# Altium schematic sheet main.SchDoc
size A4; PageSetup: Record=PageOptions|CenterHorizontal=True|CenterVertical=True|PrintScale=0.92|XCorrection=1.00|YCorrection=1.00|PrintKind=1|BorderSize=5000000|LeftOffset=0|BottomOffset=0|Orientation=2|PaperLength=1000|PaperWidth=1000|Scale=100|PaperSource=7|PrintQuality=-3|MediaType=1|DitherType=10|PaperKind=???|PrintScaleMode=1
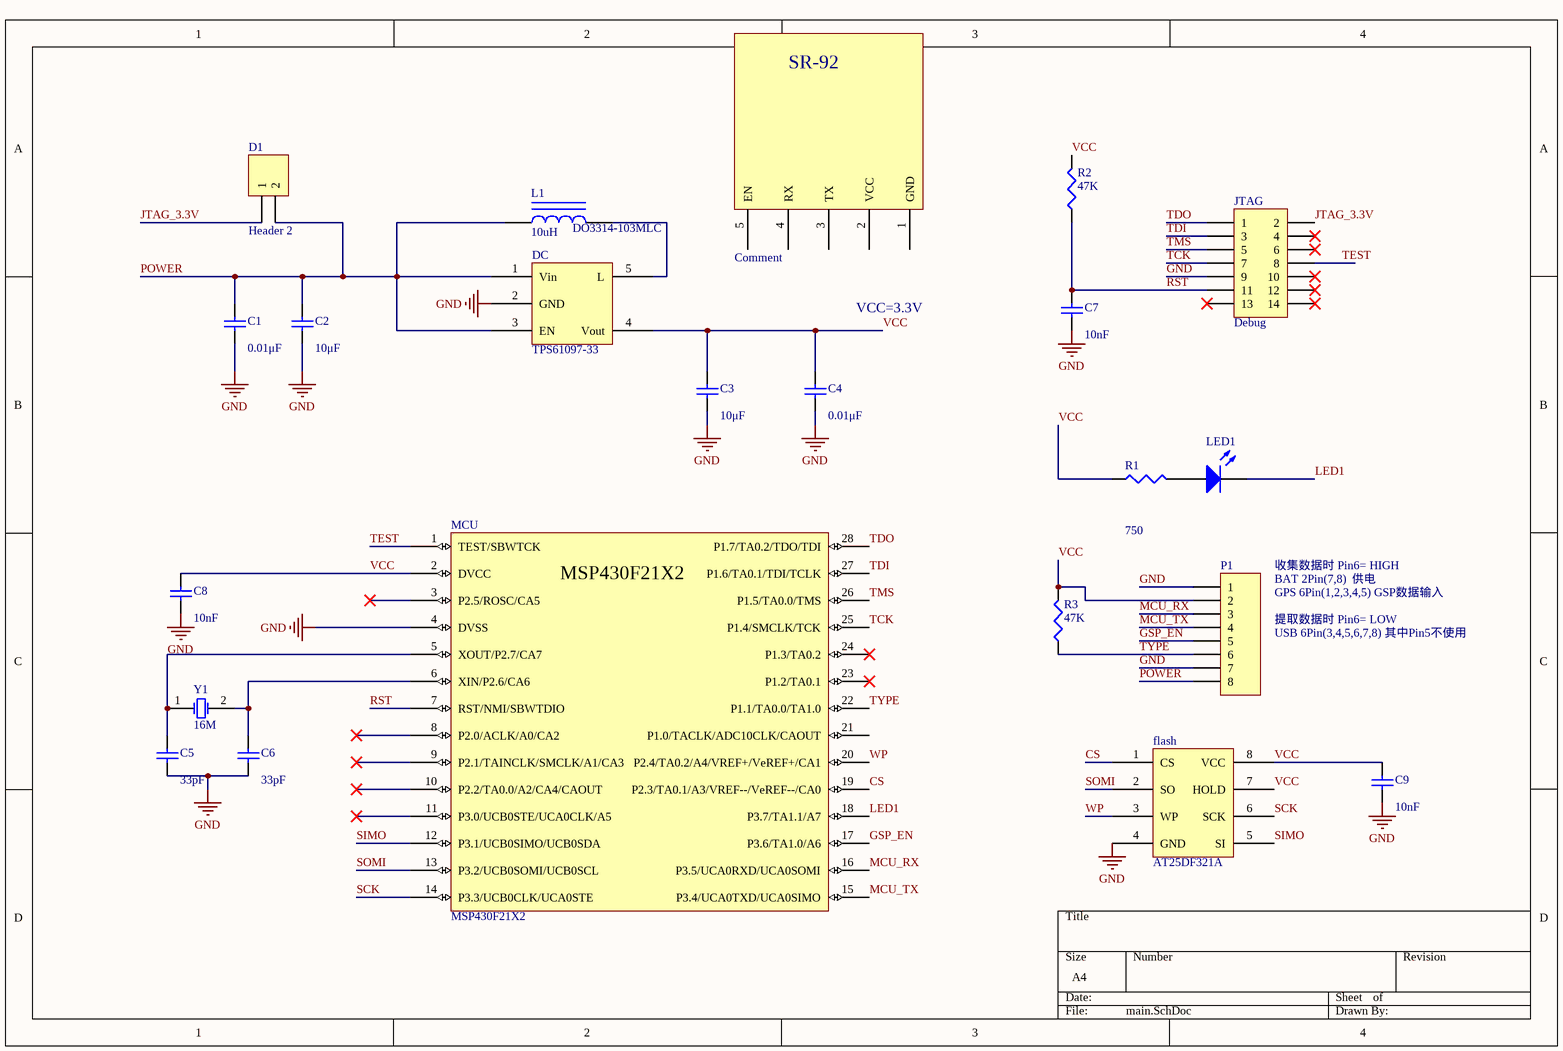
[diagram p0: main.SchDoc]

## Parts
?  Comment  [SR-92]
C1  value 0.01μF  [CAPC3216L]
C2  value 10μF  [CAPC3216L]
C3  value 10μF  [CAPC3216L]
C4  value 0.01μF  [CAPC3216L]
C5  value 33pF  [CAPC3216L]
C6  value 33pF  [CAPC3216L]
C7  value 10nF  [CAPC3216L]
C8  value 10nF  [CAPC3216L]
C9  value 10nF  [CAPC3216L]
D1  Header 2  [DO-41]
DC  TPS61097-33  [DBV005]
flash  AT25DF321A  [8S2_M]
JTAG  Debug  [HDR2X7]
L1  DO3314-103MLC  value 10uH  [DO3314]
LED1  LED2  [DSO-F2/D6.1]  (value not drawn)
MCU  MSP430F21X2  [PW028]
P1  Header 8H  [HDR1X8H]  (value not drawn)
R1  value 750  [RESC3216L]  (hidden comment: Res3)
R2  value 47K  [RESC3216L]  (hidden comment: Res3)
R3  value 47K  [RESC3216L]  (hidden comment: Res3)
Y1  16M  [DCO - 2]

## Nets
GND: C1.1 C2.1 C3.1 C4.1 C5.1 C6.1 C7.1 C8.1 C9.2 DC.2(GND) flash.4(GND) JTAG.9 MCU.4(DVSS) P1.1 P1.7
CS: flash.1(CS) MCU.19(P2.3/TA0.1/A3/VREF--/VeREF--/CA0)
GSP_EN: MCU.17(P3.6/TA1.0/A6) P1.5
JTAG_3.3V: D1.1 JTAG.2
LED1: LED1.2(K) MCU.18(P3.7/TA1.1/A7)
MCU_RX: MCU.16(P3.5/UCA0RXD/UCA0SOMI) P1.3
MCU_TX: MCU.15(P3.4/UCA0TXD/UCA0SIMO) P1.4
POWER: C1.2 C2.2 D1.2 DC.1(Vin) DC.3(EN) L1.1 P1.8
RST: C7.2 JTAG.11 MCU.7(RST/NMI/SBWTDIO) R2.1
SCK: flash.6(SCK) MCU.14(P3.3/UCB0CLK/UCA0STE)
SIMO: flash.5(SI) MCU.12(P3.1/UCB0SIMO/UCB0SDA)
SOMI: flash.2(SO) MCU.13(P3.2/UCB0SOMI/UCB0SCL)
TCK: JTAG.7 MCU.25(P1.4/SMCLK/TCK)
TDI: JTAG.3 MCU.27(P1.6/TA0.1/TDI/TCLK)
TDO: JTAG.1 MCU.28(P1.7/TA0.2/TDO/TDI)
TEST: JTAG.8 MCU.1(TEST/SBWTCK)
TMS: JTAG.5 MCU.26(P1.5/TA0.0/TMS)
TYPE: MCU.22(P1.1/TA0.0/TA1.0) P1.6 R3.1
VCC: C3.2 C4.2 C8.2 C9.1 DC.4(Vout) flash.7(HOLD) flash.8(VCC) MCU.2(DVCC) P1.2 R1.1 R2.2 R3.2
WP: flash.3(WP) MCU.20(P2.4/TA0.2/A4/VREF+/VeREF+/CA1)
NetC5_2: C5.2 MCU.5(XOUT/P2.7/CA7) Y1.1(OSC1)
NetC6_2: C6.2 MCU.6(XIN/P2.6/CA6) Y1.2(OSC2)
NetDC_5: DC.5(L) L1.2
NetLED1_1: LED1.1(A) R1.2

Not connected (* = marked no-connect by the designer): ? 1(GND) 2(VCC) 3(TX) 4(RX) 5(EN); JTAG 4* 6* 10* 12* 13* 14*; MCU 3(P2.5/ROSC/CA5)* 8(P2.0/ACLK/A0/CA2)* 9(P2.1/TAINCLK/SMCLK/A1/CA3)* 10(P2.2/TA0.0/A2/CA4/CAOUT)* 11(P3.0/UCB0STE/UCA0CLK/A5)* 21(P1.0/TACLK/ADC10CLK/CAOUT) 23(P1.2/TA0.1)* 24(P1.3/TA0.2)*

## Notes on the sheet
- VCC=3.3V
- GPS 6Pin(1,2,3,4,5) GSP数据输入
- BAT 2Pin(7,8)  供电
- 收集数据时 Pin6= HIGH
- USB 6Pin(3,4,5,6,7,8) 其中Pin5不使用
- 提取数据时 Pin6= LOW

## Library data of the parts
? = SR-92
C1-C9 = Cap Semi: Capacitor (Semiconductor SIM Model); Published: 8-Jun-2000; LatestRevisionDate: 29-May-2009; LatestRevisionNote: IPC-7351 Footprint Added.; PackageReference: C1206; Publisher: Altium Limited; PackageDescription: Chip Capacitor
D1 = Header 2: Header, 2-Pin; LatestRevisionDate: 17-Jul-2002; LatestRevisionNote: Re-released for DXP Platform.; Publisher: Altium Limited
JTAG = Header 7X2: Header, 7-Pin, Dual row; LatestRevisionDate: 17-Jul-2002; LatestRevisionNote: Re-released for DXP Platform.; Publisher: Altium Limited
L1 = Inductor Iron: Magnetic-Core Inductor; Published: 24-Mar-1999; LatestRevisionDate: 17-Jul-2002; LatestRevisionNote: Re-released for DXP Platform.; PackageReference: AXIAL-0.9; Publisher: Altium Limited
LED1 = LED2: Typical RED, GREEN, YELLOW, AMBER GaAs LED; Published: 8-Jun-2000; LatestRevisionDate: 17-Jul-2002; LatestRevisionNote: Re-released for DXP Platform.; PackageVersion: Feb-2002; PackageReference: 3.2X1.6X1.1; Publisher: Altium Limited
P1 = Header 8H: Header, 8-Pin, Right Angle; LatestRevisionDate: 17-Jul-2002; LatestRevisionNote: Re-released for DXP Platform.; Publisher: Altium Limited
R1-R3 = Res3: Resistor; Published: 8-Jun-2000; LatestRevisionDate: 29-May-2009; LatestRevisionNote: IPC-7351 Footprint Added.; PackageReference: J1-0603; Publisher: Altium Limited; PackageDescription: Chip Resistor
Y1 = XTAL: Crystal Oscillator; Published: 8-Jun-2000; LatestRevisionDate: 17-Jul-2002; LatestRevisionNote: Re-released for DXP Platform.; PackageReference: R38; Publisher: Altium Limited